# EAGLE design led_buzzer (EAGLE 5.11)
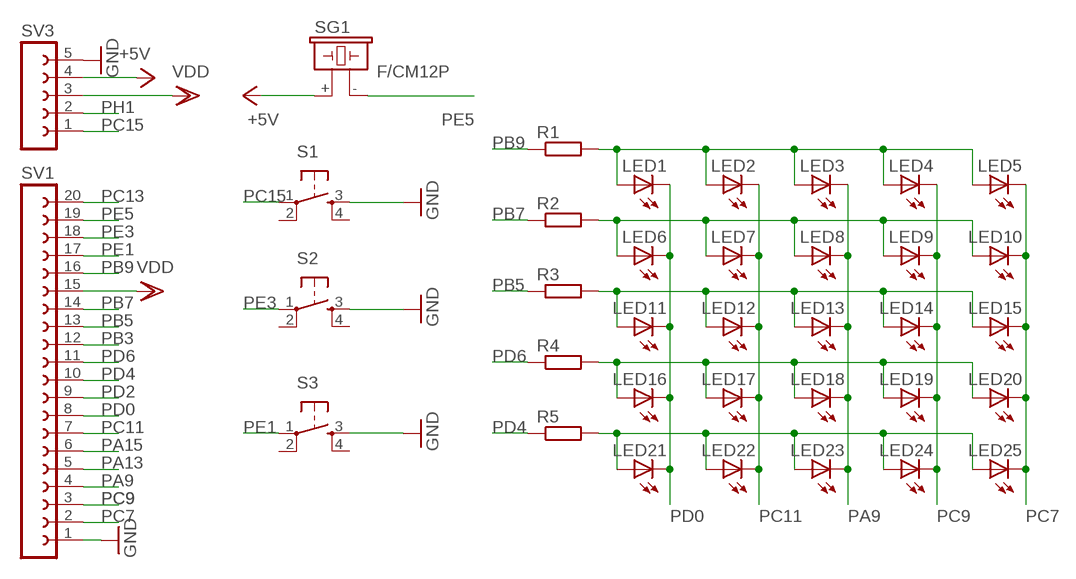
[diagram p0: schematic, sheet 1]

## Parts
LED1  LED5MM  [LED5MM]
LED2  LED5MM  [LED5MM]
LED3  LED5MM  [LED5MM]
LED4  LED5MM  [LED5MM]
LED5  LED5MM  [LED5MM]
LED6  LED5MM  [LED5MM]
LED7  LED5MM  [LED5MM]
LED8  LED5MM  [LED5MM]
LED9  LED5MM  [LED5MM]
LED10  LED5MM  [LED5MM]
LED11  LED5MM  [LED5MM]
LED12  LED5MM  [LED5MM]
LED13  LED5MM  [LED5MM]
LED14  LED5MM  [LED5MM]
LED15  LED5MM  [LED5MM]
LED16  LED5MM  [LED5MM]
LED17  LED5MM  [LED5MM]
LED18  LED5MM  [LED5MM]
LED19  LED5MM  [LED5MM]
LED20  LED5MM  [LED5MM]
LED21  LED5MM  [LED5MM]
LED22  LED5MM  [LED5MM]
LED23  LED5MM  [LED5MM]
LED24  LED5MM  [LED5MM]
LED25  LED5MM  [LED5MM]
R1  R-EU_M0805  [M0805]
R2  R-EU_M0805  [M0805]
R3  R-EU_M0805  [M0805]
R4  R-EU_M0805  [M0805]
R5  R-EU_M0805  [M0805]
S1  TAC_SWITCHPTH  [TACTILE-PTH]
S2  TAC_SWITCHPTH  [TACTILE-PTH]
S3  TAC_SWITCHPTH  [TACTILE-PTH]
SG1  F/CM12P  [F/CM12P]
SV1  FE20-1  [FE20]
SV3  FE05-1  [FE05-1]

## Nets
+5V: SG1.+ SV3.4
GND: S1.3 S2.3 S3.3 SV1.1 SV3.5
N$1: LED1.A LED2.A LED3.A LED4.A LED5.A R1.2
N$2: LED6.A LED7.A LED8.A LED9.A LED10.A R2.2
N$3: LED11.A LED12.A LED13.A LED14.A LED15.A R3.2
N$4: LED16.A LED17.A LED18.A LED19.A LED20.A R4.2
N$5: LED21.A LED22.A LED23.A LED24.A LED25.A R5.2
PA9: LED3.K(C) LED8.K(C) LED13.K(C) LED18.K(C) LED23.K(C) SV1.4
PA13: SV1.5
PA15: SV1.6
PB3: SV1.12
PB5: R3.1 SV1.13
PB7: R2.1 SV1.14
PB9: R1.1 SV1.16
PC7: LED5.K(C) LED10.K(C) LED15.K(C) LED20.K(C) LED25.K(C) SV1.2
PC9: LED4.K(C) LED9.K(C) LED14.K(C) LED19.K(C) LED24.K(C) SV1.3
PC11: LED2.K(C) LED7.K(C) LED12.K(C) LED17.K(C) LED22.K(C) SV1.7
PC13: SV1.20
PC15: S1.1 SV3.1
PD0: LED1.K(C) LED6.K(C) LED11.K(C) LED16.K(C) LED21.K(C) SV1.8
PD2: SV1.9
PD4: R5.1 SV1.10
PD6: R4.1 SV1.11
PE1: S3.1 SV1.17
PE3: S2.1 SV1.18
PE5: SG1.- SV1.19
PH1: SV3.2
VDD: SV1.15 SV3.3
Unconnected: S1.2 S1.4 S2.2 S2.4 S3.2 S3.4

## Library data of the parts
LED1-LED25 = led:LED: LED OSRAM: - CHIPLED LG R971, LG N971, LY N971, LG Q971, LY Q971, LO R971, LY R971 LH N974, LH R974 LS Q976, LO Q976, LY Q976 LO Q996 - Hyper CHIPLED LW Q18S LB Q993, LB Q99A, LB R99A - SideLED LS A670, LO A670, LY A670, LG A670, LP A670 LB A673, LV A673, LT A673, LW A673 LH A674 LY A675 LS A676, LA A676, LO A676, LY A676, LW A676 LS A679, LY A679, LG A679 - Hyper Micro SIDELED® LS Y876, LA Y876, LO Y876, LY Y876 LT Y87S - SmartLED LW L88C, LW L88S LB L89C, LB L89S, LG L890 LS L89K, LO L89K, LY L89K LS L896, LA L896, LO L896, LY L896 - TOPLED LS T670, LO T670, LY T670, LG T670, LP T670 LSG T670, LSP T670, LSY T670, LOP T670, LYG T670 LG T671, LOG T671, LSG T671 LB T673, LV T673, LT T673, LW T673 LH T674 LS T676, LA T676, LO T676, LY T676, LB T676, LH T676, LSB T676, LW T676 LB T67C, LV T67C, LT T67C, LS T67K, LO T67K, LY T67K, LW E67C LS E67B, LA E67B, LO E67B, LY E67B, LB E67C, LV E67C, LT E67C LW T67C LS T679, LY T679, LG T679 LS T770, LO T770, LY T770, LG T770, LP T770 LB T773, LV T773, LT T773, LW T773 LH T774 LS E675, LA E675, LY E675, LS T675 LS T776, LA T776, LO T776, LY T776, LB T776 LHGB T686 LT T68C, LB T68C - Hyper Mini TOPLED® LB M676 - Mini TOPLED Santana® LG M470 LS M47K, LO M47K, LY M47K Source: http://www.osram.convergy.de LUXEON: - LUMILED® LXK2-PW12-R00, LXK2-PW12-S00, LXK2-PW14-U00, LXK2-PW14-V00 LXK2-PM12-R00, LXK2-PM12-S00, LXK2-PM14-U00 LXK2-PE12-Q00, LXK2-PE12-R00, LXK2-PE12-S00, LXK2-PE14-T00, LXK2-PE14-U00 LXK2-PB12-K00, LXK2-PB12-L00, LXK2-PB12-M00, LXK2-PB14-N00, LXK2-PB14-P00, LXK2-PB14-Q00 LXK2-PR12-L00, LXK2-PR12-M00, LXK2-PR14-Q00, LXK2-PR14-R00 LXK2-PD12-Q00, LXK2-PD12-R00, LXK2-PD12-S00 LXK2-PH12-R00, LXK2-PH12-S00 LXK2-PL12-P00, LXK2-PL12-Q00, LXK2-PL12-R00 Source: www.luxeon.com KINGBRIGHT: KA-3528ASYC Source: www.kingbright.com
R1-R5 = rcl:R-EU_: RESISTOR, European symbol
S1-S3 = SparkFun:TAC_SWITCH: Momentary Switch Button commonly used for reset or general input. Spark Fun Electronics SKU : COM-00097
SG1 = buzzer:F/CM12P: BUZZER Source: Buerklin; OC_FARNELL: unknown; OC_NEWARK: unknown
SV1 = con-lsta:FE20-1: FEMALE HEADER; OC_FARNELL: unknown; OC_NEWARK: unknown
SV3 = con-lsta:FE05-1: FEMALE HEADER; OC_FARNELL: unknown; OC_NEWARK: unknown

## Board
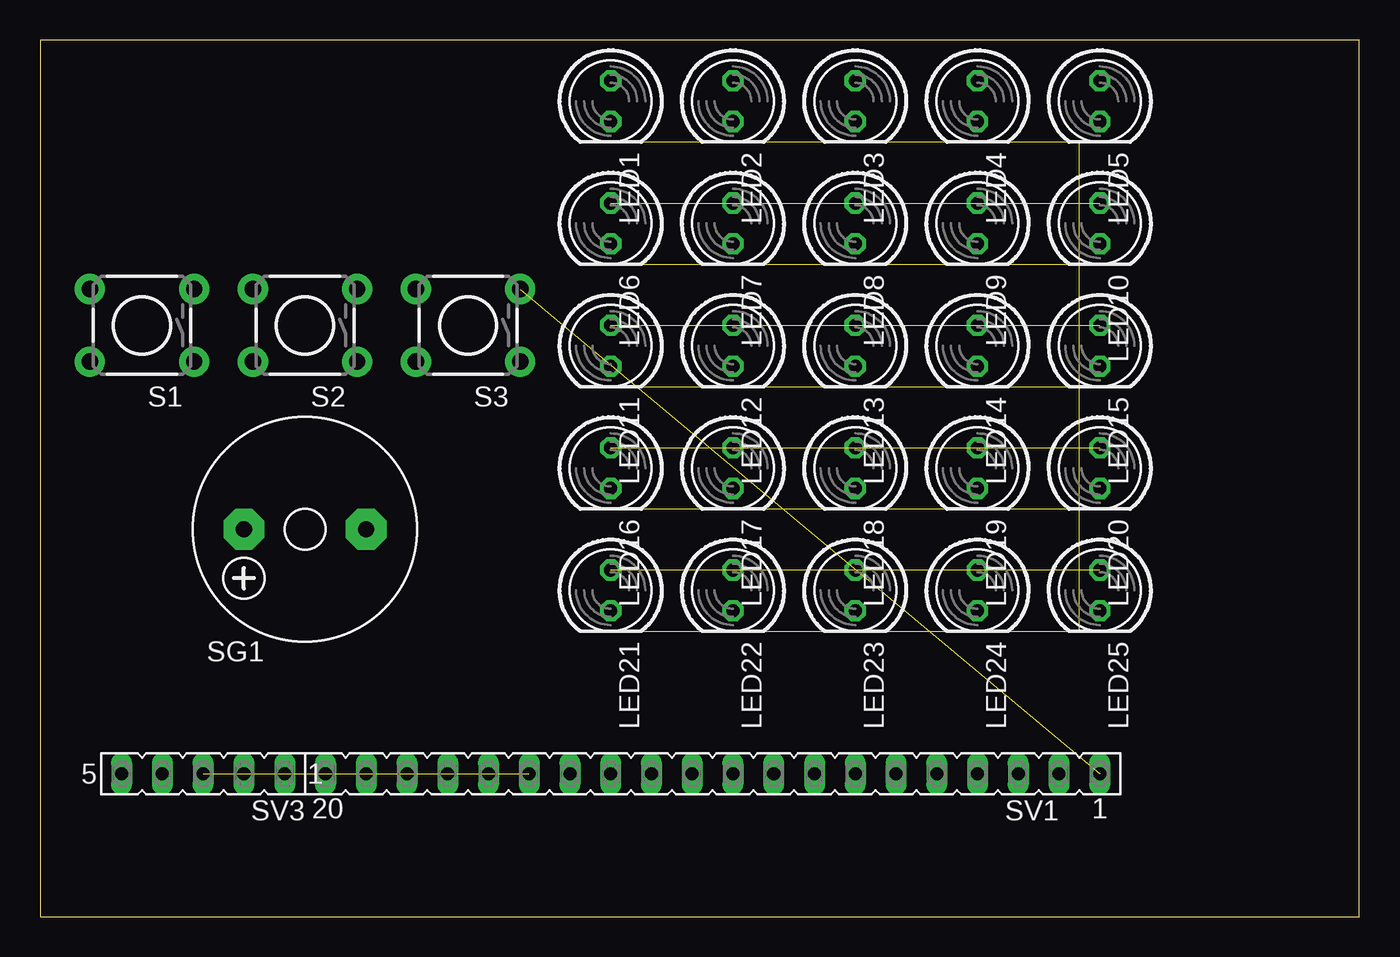
[diagram p1: board, top side]
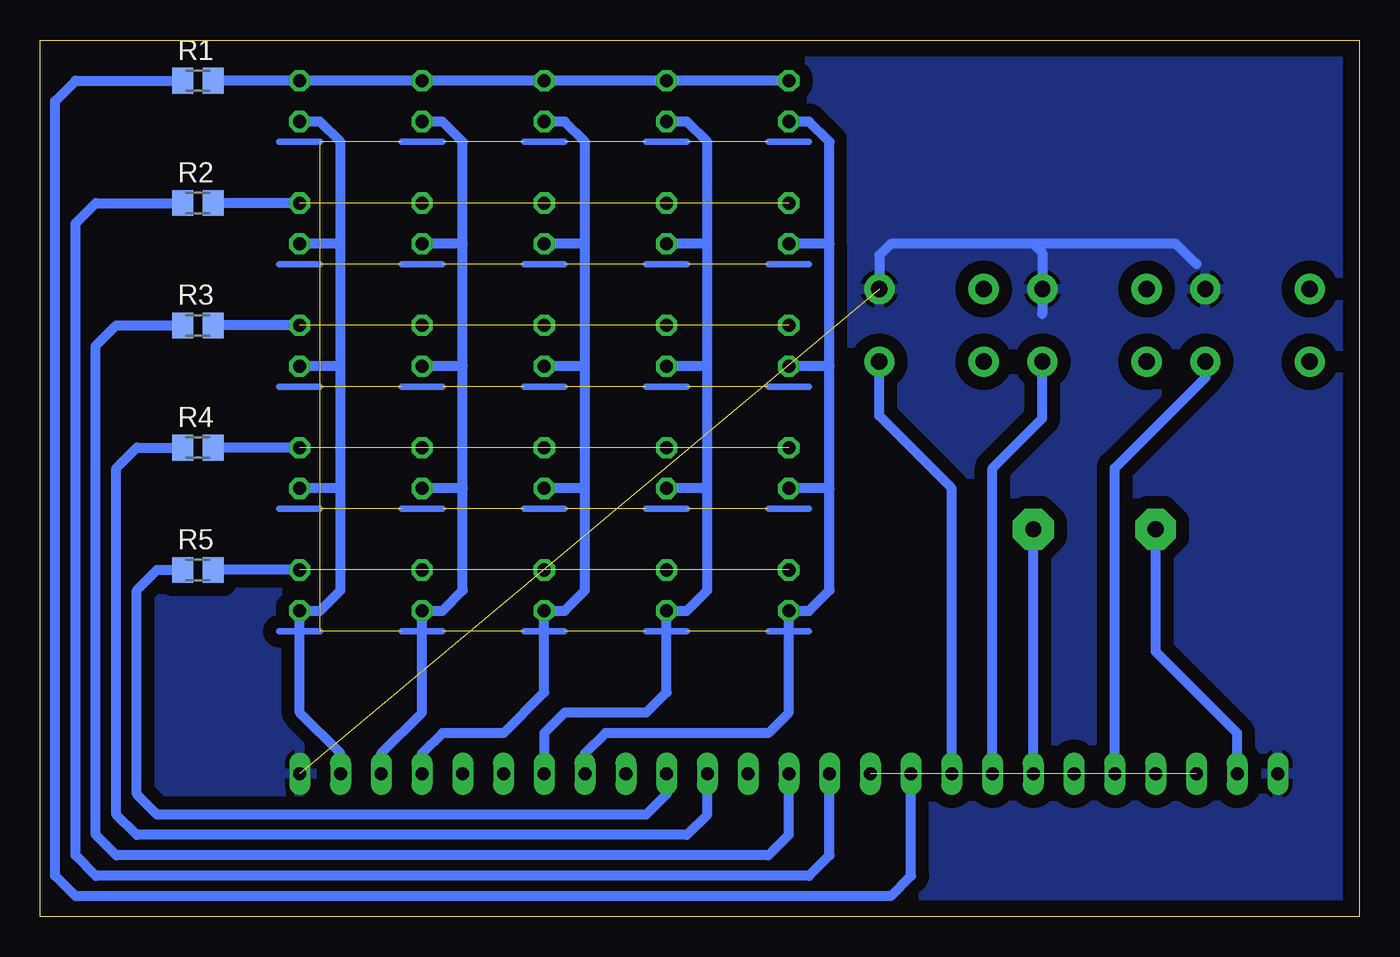
[diagram p2: board, bottom side, seen from below]

Size 82.22 x 54.6 mm. Coordinates in mm from the lower left corner, seen from the top.
Outline: 0,0 82.22,0 82.22,54.6 0,54.6 0,0
Copper layers (1*16): Top 0.035mm / dielectric 1.5mm / Bottom 0.035mm
Design rules "default *": minimum track width 0.4mm, minimum drill 24mil, track to track 8mil, track to pad 8mil, pad to pad 8mil, via to via 8mil, smd to smd 8mil, copper to edge 40mil, drill to drill 8mil, minimum pad ring 10mil, minimum via ring 8mil, stop-mask expansion 4mil, vias tented up to drill 0mil, thermal gap 10mil

### Footprints (pad centres in the part's own frame; a part is rotated, then mirrored left to right if it is on the bottom)
LED5MM = drill 0.813 octagon: A -1.27,0; K 1.27,0
M0805 = smd 1.3 x 1.6: 1 -0.95,0; 2 0.95,0
TACTILE-PTH = drill 1.016 pad 1.88 round: 1 -3.251,2.261; 2 3.251,2.261; 3 -3.251,-2.261; 4 3.251,-2.261
F/CM12P = drill 1.016 pad 2.54 octagon: + 3.81,0; - -3.81,0
FE20 = drill 0.813 long: 1 -24.13,0; 2 -21.59,0; 3 -19.05,0; 4 -16.51,0; 5 -13.97,0; 6 -11.43,0; 7 -8.89,0; 8 -6.35,0; 9 -3.81,0; 10 -1.27,0; 11 1.27,0; 12 3.81,0; 13 6.35,0; 14 8.89,0; 15 11.43,0; 16 13.97,0; 17 16.51,0; 18 19.05,0; 19 21.59,0; 20 24.13,0
FE05-1 = drill 0.813 long: 1 -5.08,0; 2 -2.54,0; 3 0,0; 4 2.54,0; 5 5.08,0

### Placement (x,y rotation side)
LED1  35.56,50.8 270 top
LED2  43.18,50.8 270 top
LED3  50.8,50.8 270 top
LED4  58.42,50.8 270 top
LED5  66.04,50.8 270 top
LED6  35.56,43.18 270 top
LED7  43.18,43.18 270 top
LED8  50.8,43.18 270 top
LED9  58.42,43.18 270 top
LED10  66.04,43.18 270 top
LED11  35.56,35.56 270 top
LED12  43.18,35.56 270 top
LED13  50.8,35.56 270 top
LED14  58.42,35.56 270 top
LED15  66.04,35.56 270 top
LED16  35.56,27.94 270 top
LED17  43.18,27.94 270 top
LED18  50.8,27.94 270 top
LED19  58.42,27.94 270 top
LED20  66.04,27.94 270 top
LED21  35.56,20.32 270 top
LED22  43.18,20.32 270 top
LED23  50.8,20.32 270 top
LED24  58.42,20.32 270 top
LED25  66.04,20.32 270 top
R1  72.39,52.07 0 bottom
R2  72.39,44.45 0 bottom
R3  72.39,36.83 0 bottom
R4  72.39,29.21 0 bottom
R5  72.39,21.59 0 bottom
S1  6.35,36.83 180 top
S2  16.51,36.83 180 top
S3  26.67,36.83 180 top
SG1  16.51,24.13 180 top
SV1  41.91,8.89 180 top
SV3  10.16,8.89 180 top

### Tracks (layer width: path | path; a pad name or v marks a point on that pad's centre or on a via)
+5V
  Bottom 0.61: SG1.+ 12.7,16.51 7.62,11.43 SV3.4
GND  (1 unrouted)
  Bottom 0.61: 19.76,37.54 S2.3 19.76,41.35 20.32,41.91 | S3.3 29.92,41.2 29.21,41.91 20.32,41.91 | 20.32,41.91 11.43,41.91 10.16,40.64 | S1.3 9.6,38.81
  pour Bottom (isolate 0.813): 0,54.61 0,0 82.55,0 82.55,54.61
  pour Bottom: 0,54.61 0,41.91 31.75,41.91 31.75,54.61
N$1
  Bottom 0.61: R1.2 LED5.A LED4.A LED3.A LED2.A LED1.A
N$2  (4 unrouted)
  Bottom 0.61: LED10.A R2.2
N$3  (4 unrouted)
  Bottom 0.61: LED15.A R3.2
N$4  (4 unrouted)
  Bottom 0.61: LED20.A R4.2
N$5  (4 unrouted)
  Bottom 0.61: LED25.A R5.2
N$6  (24 unrouted)
  Bottom 0.406: 64.77,48.26 67.31,48.26 | 57.15,48.26 59.69,48.26 | 49.53,48.26 52.07,48.26 | 41.91,48.26 44.45,48.26 | 34.29,48.26 36.83,48.26 | 34.29,40.64 36.83,40.64 | 41.91,40.64 44.45,40.64 | 49.53,40.64 52.07,40.64 | 57.15,40.64 59.69,40.64 | 64.77,40.64 67.31,40.64 | 64.77,33.02 67.31,33.02 | 57.15,33.02 59.69,33.02 | 49.53,33.02 52.07,33.02 | 41.91,33.02 44.45,33.02 | 34.29,33.02 36.83,33.02 | 34.29,25.4 36.83,25.4 | 41.91,25.4 44.45,25.4 | 49.53,25.4 52.07,25.4 | 57.15,25.4 59.69,25.4 | 64.77,25.4 67.31,25.4 | 57.15,17.78 59.69,17.78 | 49.53,17.78 52.07,17.78 | 41.91,17.78 44.45,17.78 | 34.29,17.78 36.83,17.78 | 64.77,17.78 67.31,17.78 64.77,17.78
N$7
  pour Bottom: 3.81,27.94 10.16,27.94 10.16,20.32 3.81,20.32
PA9
  Bottom 0.61: SV1.4 58.42,10.16 57.15,11.43 53.34,11.43 50.8,13.97 LED23.K 49.53,19.05 48.26,20.32 48.26,26.67 | LED3.K 49.53,49.53 48.26,48.26 48.26,41.91 | 48.26,26.67 48.26,34.29 | 48.26,34.29 48.26,41.91 | 48.26,41.91 LED8.K | 48.26,34.29 LED13.K | 48.26,26.67 LED18.K
PB5
  Bottom 0.61: R3.1 77.47,36.83 78.74,35.56 78.74,5.08 77.47,3.81 36.83,3.81 35.56,5.08 SV1.13
PB7
  Bottom 0.61: R2.1 78.74,44.45 80.01,43.18 80.01,3.81 78.74,2.54 34.29,2.54 33.02,3.81 SV1.14
PB9
  Bottom 0.61: R1.1 80.01,52.07 81.28,50.8 81.28,2.54 80.01,1.27 29.21,1.27 27.94,2.54 SV1.16
PC7
  Bottom 0.61: SV1.2 63.5,10.16 66.04,12.7 LED25.K 64.77,19.05 63.5,20.32 63.5,26.67 | LED5.K 64.77,49.53 63.5,48.26 63.5,41.91 | 63.5,26.67 63.5,34.29 | 63.5,34.29 63.5,41.91 | 63.5,41.91 LED10.K | 63.5,34.29 LED15.K | 63.5,26.67 LED20.K
PC9
  Bottom 0.61: SV1.3 60.96,10.16 58.42,12.7 LED24.K 57.15,19.05 55.88,20.32 55.88,26.67 | LED4.K 57.15,49.53 55.88,48.26 55.88,41.91 | 55.88,26.67 55.88,34.29 | 55.88,34.29 55.88,41.91 | 55.88,41.91 LED9.K | 55.88,34.29 LED14.K | 55.88,26.67 LED19.K
PC11
  Bottom 0.61: SV1.7 50.8,11.43 49.53,12.7 44.45,12.7 43.18,13.97 LED22.K 41.91,19.05 40.64,20.32 40.64,26.67 | LED2.K 41.91,49.53 40.64,48.26 40.64,41.91 | 40.64,26.67 40.64,34.29 | 40.64,34.29 40.64,41.91 | 40.64,41.91 LED7.K | 40.64,34.29 LED12.K | 40.64,26.67 LED17.K
PC15
  Bottom 0.61: S1.1 9.6,33.58 15.24,27.94 SV3.1
PD0
  Bottom 0.61: SV1.8 48.26,10.16 46.99,11.43 36.83,11.43 35.56,12.7 LED21.K 34.29,19.05 33.02,20.32 33.02,26.67 | LED1.K 34.29,49.53 33.02,48.26 33.02,41.91 | 33.02,26.67 33.02,34.29 | 33.02,34.29 33.02,41.91 | 33.02,41.91 LED6.K | 33.02,34.29 LED11.K | 33.02,26.67 LED16.K
PD4
  Bottom 0.61: R5.1 74.93,21.59 76.2,20.32 76.2,7.62 74.93,6.35 44.45,6.35 43.18,7.62 SV1.10
PD6
  Bottom 0.61: R4.1 76.2,29.21 77.47,27.94 77.47,6.35 76.2,5.08 41.91,5.08 40.64,6.35 SV1.11
PE1
  Bottom 0.61: S3.1 29.92,31.19 25.4,26.67 SV1.17
PE3
  Bottom 0.61: S2.1 19.76,31.04 22.86,27.94 SV1.18
PE5
  Bottom 0.61: SV1.19 SG1.-
VDD  (1 unrouted)

### Text on the board
bRestrict: <<</>> | +